# EAGLE schematic interro-io-board-r1 (EAGLE 5.11)
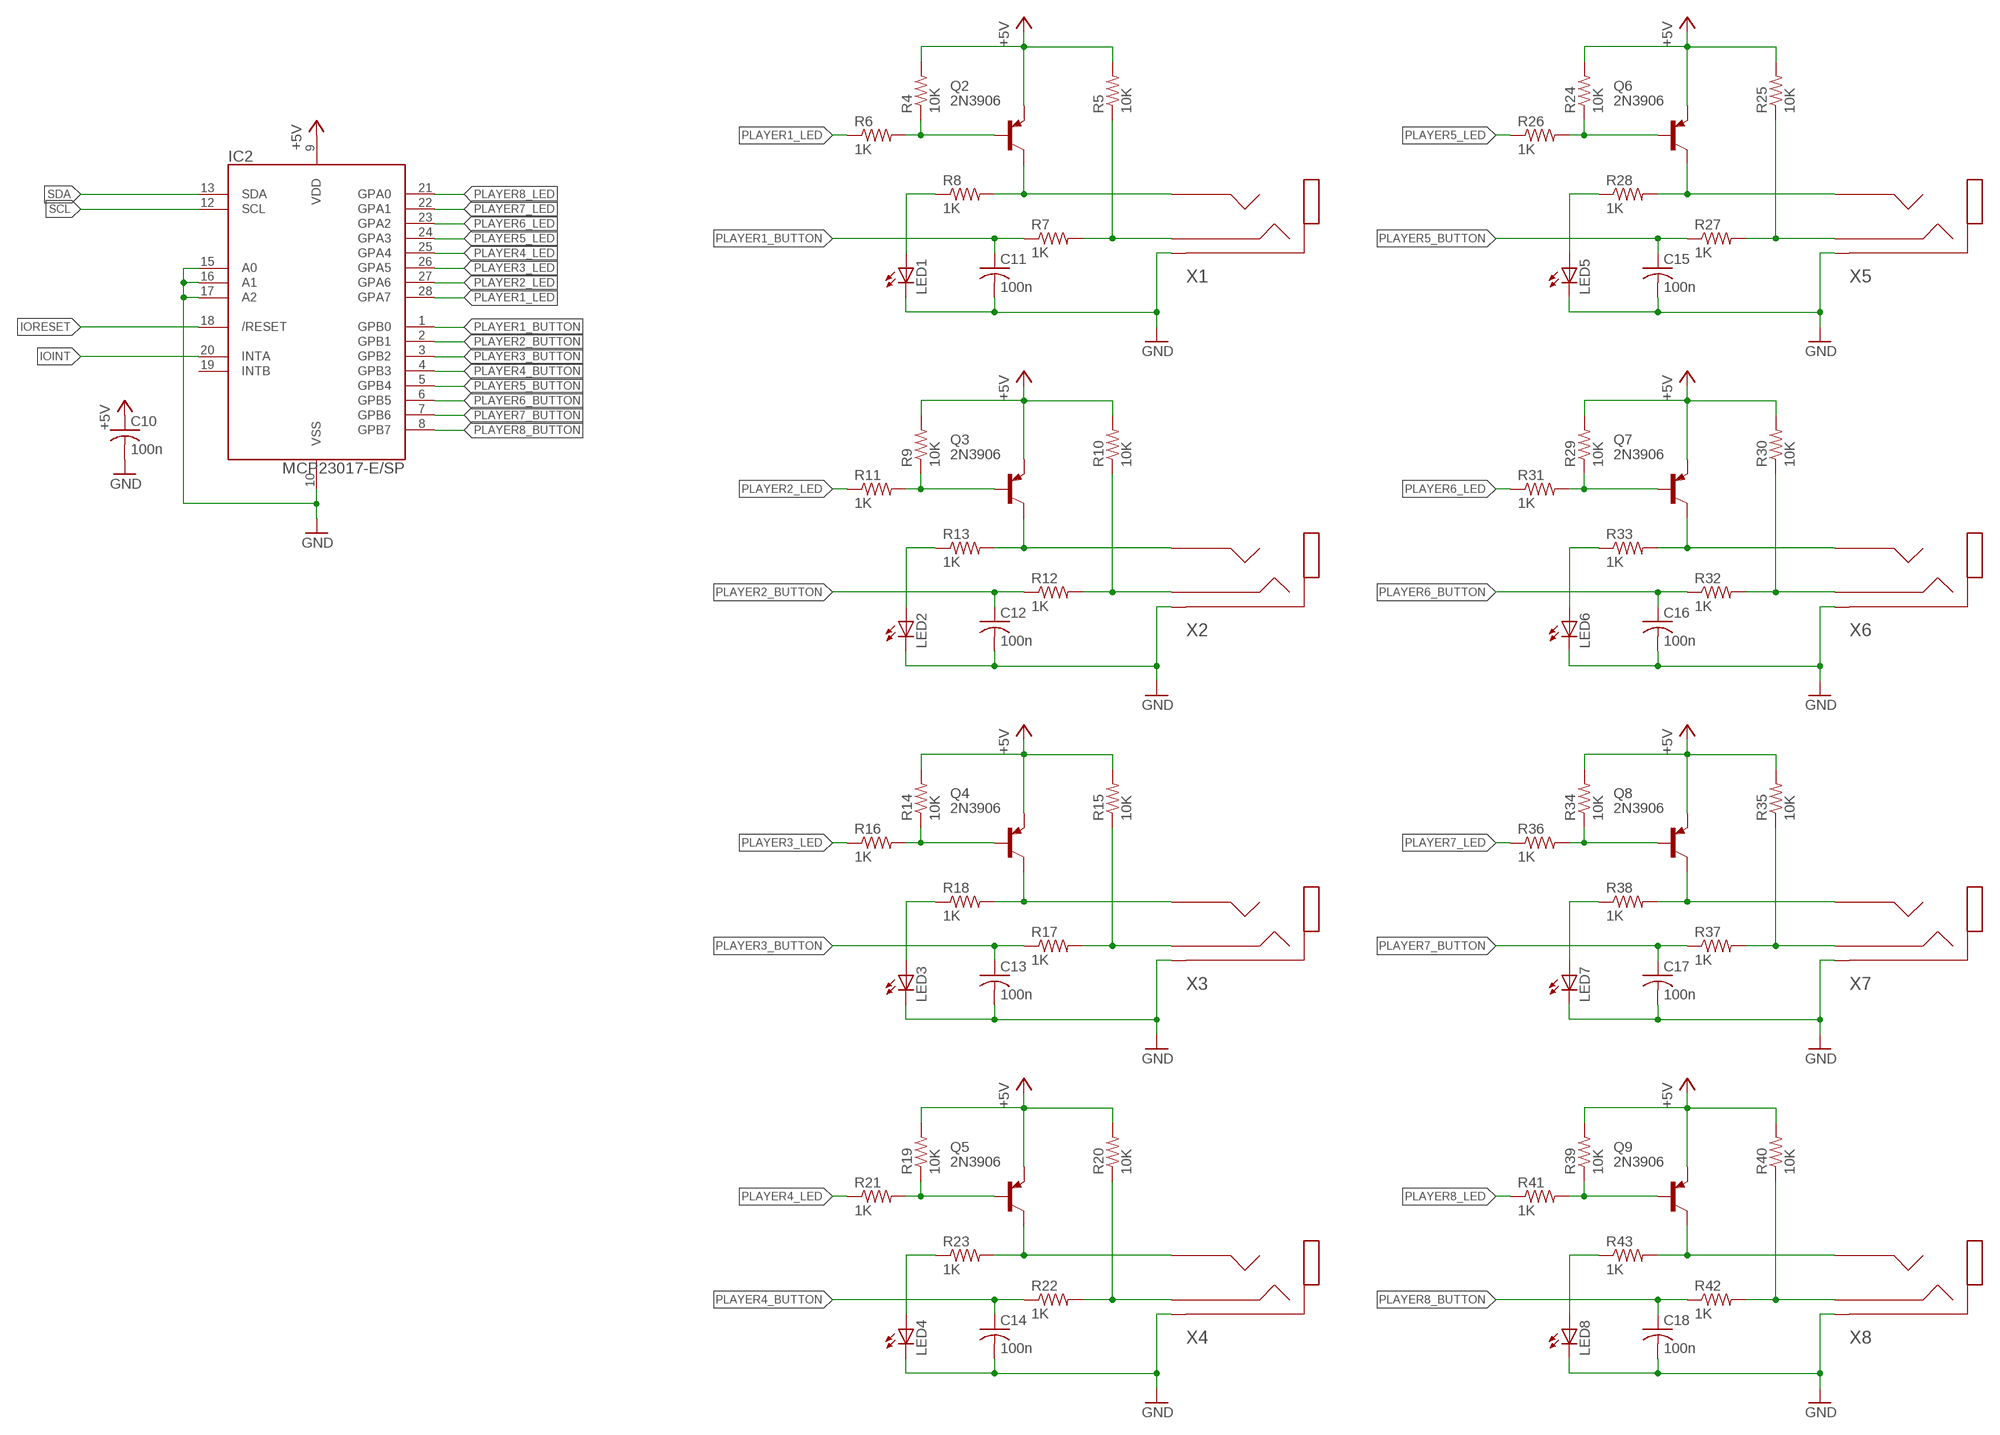
[diagram p0: schematic, sheet 1]

## Parts
C10  100n  C-US050-025X075  [C050-025X075]
C11  100n  C-US050-025X075  [C050-025X075]
C12  100n  C-US050-025X075  [C050-025X075]
C13  100n  C-US050-025X075  [C050-025X075]
C14  100n  C-US050-025X075  [C050-025X075]
C15  100n  C-US050-025X075  [C050-025X075]
C16  100n  C-US050-025X075  [C050-025X075]
C17  100n  C-US050-025X075  [C050-025X075]
C18  100n  C-US050-025X075  [C050-025X075]
IC2  MCP23017-E/SP  [DIP-28S]
LED1  LED5MM  [LED5MM]
LED2  LED5MM  [LED5MM]
LED3  LED5MM  [LED5MM]
LED4  LED5MM  [LED5MM]
LED5  LED5MM  [LED5MM]
LED6  LED5MM  [LED5MM]
LED7  LED5MM  [LED5MM]
LED8  LED5MM  [LED5MM]
Q2  2N3906  [TO92]
Q3  2N3906  [TO92]
Q4  2N3906  [TO92]
Q5  2N3906  [TO92]
Q6  2N3906  [TO92]
Q7  2N3906  [TO92]
Q8  2N3906  [TO92]
Q9  2N3906  [TO92]
R4  10K  R-US_0207/7  [0207/7]
R5  10K  R-US_0207/7  [0207/7]
R6  1K  R-US_0207/7  [0207/7]
R7  1K  R-US_0207/7  [0207/7]
R8  1K  R-US_0207/7  [0207/7]
R9  10K  R-US_0207/7  [0207/7]
R10  10K  R-US_0207/7  [0207/7]
R11  1K  R-US_0207/7  [0207/7]
R12  1K  R-US_0207/7  [0207/7]
R13  1K  R-US_0207/7  [0207/7]
R14  10K  R-US_0207/7  [0207/7]
R15  10K  R-US_0207/7  [0207/7]
R16  1K  R-US_0207/7  [0207/7]
R17  1K  R-US_0207/7  [0207/7]
R18  1K  R-US_0207/7  [0207/7]
R19  10K  R-US_0207/7  [0207/7]
R20  10K  R-US_0207/7  [0207/7]
R21  1K  R-US_0207/7  [0207/7]
R22  1K  R-US_0207/7  [0207/7]
R23  1K  R-US_0207/7  [0207/7]
R24  10K  R-US_0207/7  [0207/7]
R25  10K  R-US_0207/7  [0207/7]
R26  1K  R-US_0207/7  [0207/7]
R27  1K  R-US_0207/7  [0207/7]
R28  1K  R-US_0207/7  [0207/7]
R29  10K  R-US_0207/7  [0207/7]
R30  10K  R-US_0207/7  [0207/7]
R31  1K  R-US_0207/7  [0207/7]
R32  1K  R-US_0207/7  [0207/7]
R33  1K  R-US_0207/7  [0207/7]
R34  10K  R-US_0207/7  [0207/7]
R35  10K  R-US_0207/7  [0207/7]
R36  1K  R-US_0207/7  [0207/7]
R37  1K  R-US_0207/7  [0207/7]
R38  1K  R-US_0207/7  [0207/7]
R39  10K  R-US_0207/7  [0207/7]
R40  10K  R-US_0207/7  [0207/7]
R41  1K  R-US_0207/7  [0207/7]
R42  1K  R-US_0207/7  [0207/7]
R43  1K  R-US_0207/7  [0207/7]
X1  SJ1-3533N  [SJ1-3533N]
X2  SJ1-3533N  [SJ1-3533N]
X3  SJ1-3533N  [SJ1-3533N]
X4  SJ1-3533N  [SJ1-3533N]
X5  SJ1-3533N  [SJ1-3533N]
X6  SJ1-3533N  [SJ1-3533N]
X7  SJ1-3533N  [SJ1-3533N]
X8  SJ1-3533N  [SJ1-3533N]

## Nets
+5V: C10.1 IC2.9(VDD) Q2.3(E) Q3.3(E) Q4.3(E) Q5.3(E) Q6.3(E) Q7.3(E) Q8.3(E) Q9.3(E) R4.2 R5.2 R9.2 R10.2 R14.2 R15.2 R19.2 R20.2 R24.2 R25.2 R29.2 R30.2 R34.2 R35.2 R39.2 R40.2
GND: C10.2 C11.2 C12.2 C13.2 C14.2 C15.2 C16.2 C17.2 C18.2 IC2.10(VSS) IC2.15(A0) IC2.16(A1) IC2.17(A2) LED1.K(C) LED2.K(C) LED3.K(C) LED4.K(C) LED5.K(C) LED6.K(C) LED7.K(C) LED8.K(C) X1.SHIELD(SLEEVE) X2.SHIELD(SLEEVE) X3.SHIELD(SLEEVE) X4.SHIELD(SLEEVE) X5.SHIELD(SLEEVE) X6.SHIELD(SLEEVE) X7.SHIELD(SLEEVE) X8.SHIELD(SLEEVE)
IOINT: IC2.20(INTA)
IORESET: IC2.18(/RESET)
N$9: R5.1 R7.2 X1.RING
N$10: Q2.1(C) R8.2 X1.TIP
N$12: Q2.2(B) R4.1 R6.2
N$13: LED1.A R8.1
N$14: R10.1 R12.2 X2.RING
N$15: Q3.1(C) R13.2 X2.TIP
N$16: Q3.2(B) R9.1 R11.2
N$17: LED2.A R13.1
N$18: R15.1 R17.2 X3.RING
N$19: Q4.1(C) R18.2 X3.TIP
N$20: Q4.2(B) R14.1 R16.2
N$21: LED3.A R18.1
N$22: R20.1 R22.2 X4.RING
N$23: Q5.1(C) R23.2 X4.TIP
N$24: Q5.2(B) R19.1 R21.2
N$25: LED4.A R23.1
N$26: R25.1 R27.2 X5.RING
N$27: Q6.1(C) R28.2 X5.TIP
N$28: Q6.2(B) R24.1 R26.2
N$29: LED5.A R28.1
N$30: R30.1 R32.2 X6.RING
N$31: Q7.1(C) R33.2 X6.TIP
N$32: Q7.2(B) R29.1 R31.2
N$33: LED6.A R33.1
N$34: R35.1 R37.2 X7.RING
N$35: Q8.1(C) R38.2 X7.TIP
N$36: Q8.2(B) R34.1 R36.2
N$37: LED7.A R38.1
N$38: R40.1 R42.2 X8.RING
N$39: Q9.1(C) R43.2 X8.TIP
N$40: Q9.2(B) R39.1 R41.2
N$41: LED8.A R43.1
PLAYER1_BUTTON: C11.1 IC2.1(GPB0) R7.1
PLAYER1_LED: IC2.28(GPA7) R6.1
PLAYER2_BUTTON: C12.1 IC2.2(GPB1) R12.1
PLAYER2_LED: IC2.27(GPA6) R11.1
PLAYER3_BUTTON: C13.1 IC2.3(GPB2) R17.1
PLAYER3_LED: IC2.26(GPA5) R16.1
PLAYER4_BUTTON: C14.1 IC2.4(GPB3) R22.1
PLAYER4_LED: IC2.25(GPA4) R21.1
PLAYER5_BUTTON: C15.1 IC2.5(GPB4) R27.1
PLAYER5_LED: IC2.24(GPA3) R26.1
PLAYER6_BUTTON: C16.1 IC2.6(GPB5) R32.1
PLAYER6_LED: IC2.23(GPA2) R31.1
PLAYER7_BUTTON: C17.1 IC2.7(GPB6) R37.1
PLAYER7_LED: IC2.22(GPA1) R36.1
PLAYER8_BUTTON: C18.1 IC2.8(GPB7) R42.1
PLAYER8_LED: IC2.21(GPA0) R41.1
Unconnected: IC2.12(SCL) IC2.13(SDA) IC2.19(INTB)

## Library data of the parts
C10-C18 = rcl:C-US: CAPACITOR, American symbol
IC2 = rbg-microchip-ioexpander:MCP23017
LED1-LED8 = led:LED: LED OSRAM: - CHIPLED LG R971, LG N971, LY N971, LG Q971, LY Q971, LO R971, LY R971 LH N974, LH R974 LS Q976, LO Q976, LY Q976 LO Q996 - Hyper CHIPLED LW Q18S LB Q993, LB Q99A, LB R99A - SideLED LS A670, LO A670, LY A670, LG A670, LP A670 LB A673, LV A673, LT A673, LW A673 LH A674 LY A675 LS A676, LA A676, LO A676, LY A676, LW A676 LS A679, LY A679, LG A679 - Hyper Micro SIDELED® LS Y876, LA Y876, LO Y876, LY Y876 LT Y87S - SmartLED LW L88C, LW L88S LB L89C, LB L89S, LG L890 LS L89K, LO L89K, LY L89K LS L896, LA L896, LO L896, LY L896 - TOPLED LS T670, LO T670, LY T670, LG T670, LP T670 LSG T670, LSP T670, LSY T670, LOP T670, LYG T670 LG T671, LOG T671, LSG T671 LB T673, LV T673, LT T673, LW T673 LH T674 LS T676, LA T676, LO T676, LY T676, LB T676, LH T676, LSB T676, LW T676 LB T67C, LV T67C, LT T67C, LS T67K, LO T67K, LY T67K, LW E67C LS E67B, LA E67B, LO E67B, LY E67B, LB E67C, LV E67C, LT E67C LW T67C LS T679, LY T679, LG T679 LS T770, LO T770, LY T770, LG T770, LP T770 LB T773, LV T773, LT T773, LW T773 LH T774 LS E675, LA E675, LY E675, LS T675 LS T776, LA T776, LO T776, LY T776, LB T776 LHGB T686 LT T68C, LB T68C - Hyper Mini TOPLED® LB M676 - Mini TOPLED Santana® LG M470 LS M47K, LO M47K, LY M47K Source: http://www.osram.convergy.de LUXEON: - LUMILED® LXK2-PW12-R00, LXK2-PW12-S00, LXK2-PW14-U00, LXK2-PW14-V00 LXK2-PM12-R00, LXK2-PM12-S00, LXK2-PM14-U00 LXK2-PE12-Q00, LXK2-PE12-R00, LXK2-PE12-S00, LXK2-PE14-T00, LXK2-PE14-U00 LXK2-PB12-K00, LXK2-PB12-L00, LXK2-PB12-M00, LXK2-PB14-N00, LXK2-PB14-P00, LXK2-PB14-Q00 LXK2-PR12-L00, LXK2-PR12-M00, LXK2-PR14-Q00, LXK2-PR14-R00 LXK2-PD12-Q00, LXK2-PD12-R00, LXK2-PD12-S00 LXK2-PH12-R00, LXK2-PH12-S00 LXK2-PL12-P00, LXK2-PL12-Q00, LXK2-PL12-R00 Source: www.luxeon.com KINGBRIGHT: KA-3528ASYC Source: www.kingbright.com
Q2-Q9 = transistor-pnp:2N3906: PNP Transistor
R4-R43 = rcl:R-US_: RESISTOR, American symbol
X1-X8 = rbg-cui-audio:SJ1-3533N